# Altium schematic sheet 02-MCU.SchDoc
size A3
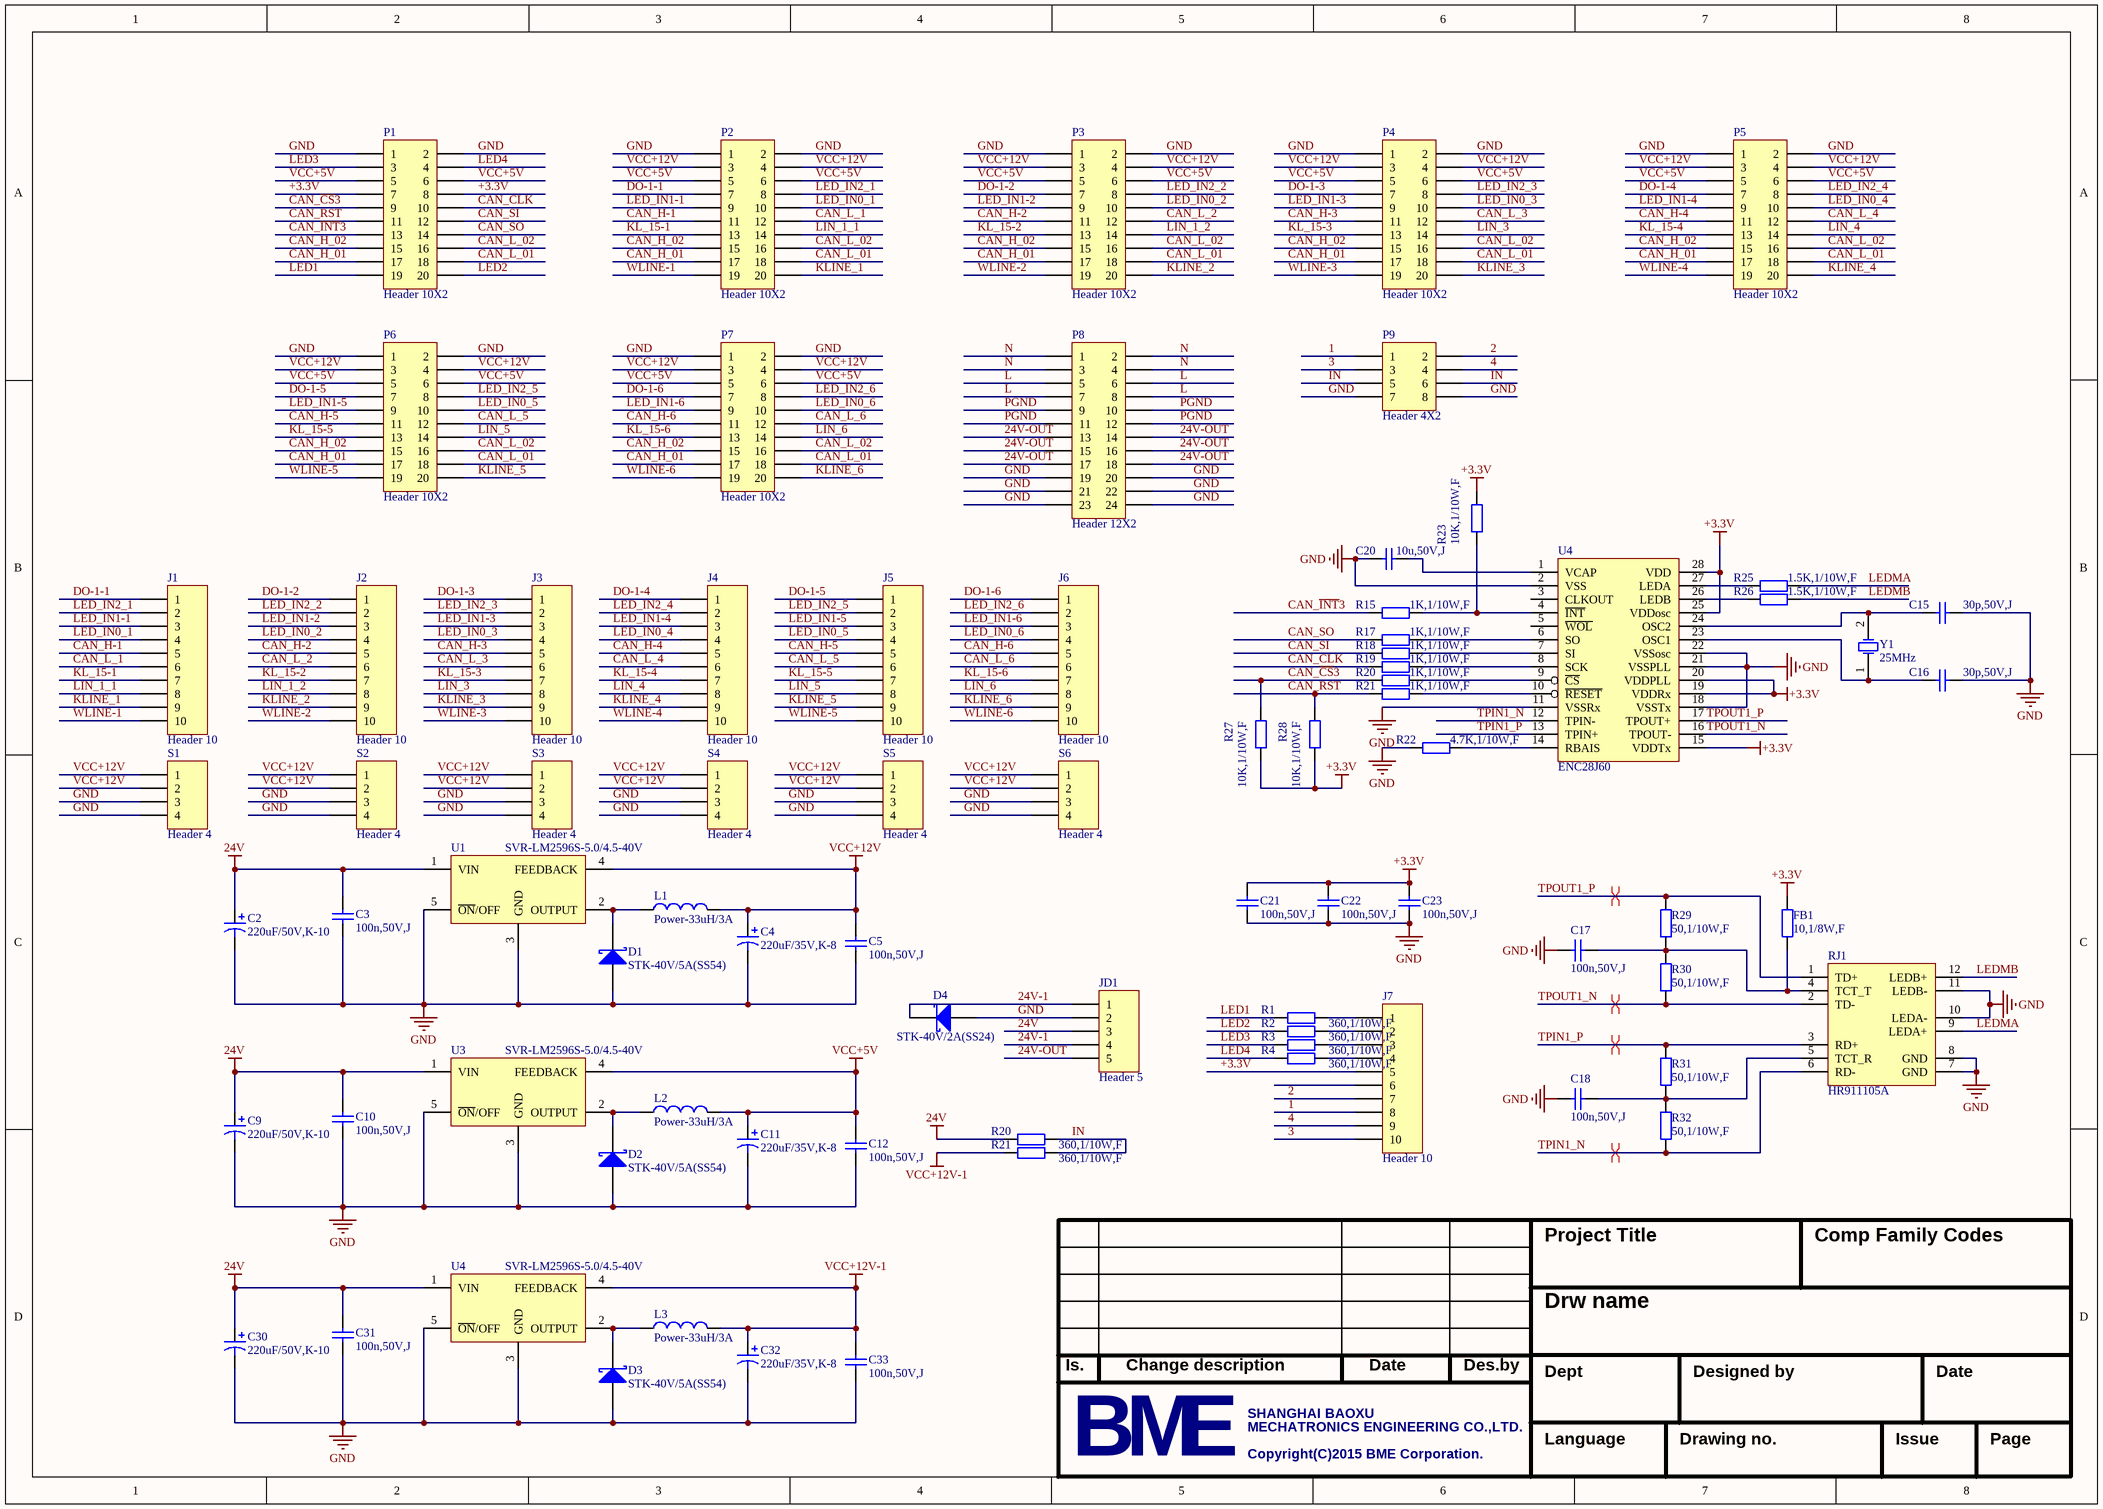
[diagram p0: 02-MCU.SchDoc]

## Parts
(Parts that share a designator on the sheet are numbered #1, #2 ... from top to bottom, then left to right.)
C2  220uF/50V,K-10  [ED10]
C3  100n,50V,J  [C0603]
C4  220uF/35V,K-8  [ED8]
C5  100n,50V,J  [C0603]
C9  220uF/50V,K-10  [ED10]
C10  100n,50V,J  [C0603]
C11  220uF/35V,K-8  [ED8]
C12  100n,50V,J  [C0603]
C15  30p,50V,J  [C0603]
C16  30p,50V,J  [C0603]
C17  100n,50V,J  [C0603]
C18  100n,50V,J  [C0603]
C20  10u,50V,J  [C0603]
C21  100n,50V,J  [C0603]
C22  100n,50V,J  [C0603]
C23  100n,50V,J  [C0603]
C30  220uF/50V,K-10  [ED10]
C31  100n,50V,J  [C0603]
C32  220uF/35V,K-8  [ED8]
C33  100n,50V,J  [C0603]
D1  STK-40V/5A(SS54)  [SMA]
D2  STK-40V/5A(SS54)  [SMA]
D3  STK-40V/5A(SS54)  [SMA]
D4  STK-40V/2A(SS24)  [SMA]
FB1  10,1/8W,F  [R0805]
J1  Header 10  [PH2.54-10V]
J2  Header 10  [PH2.54-10V]
J3  Header 10  [PH2.54-10V]
J4  Header 10  [PH2.54-10V]
J5  Header 10  [PH2.54-10V]
J6  Header 10  [PH2.54-10V]
J7  Header 10  [PH2.54-10V]
JD1  Header 5  [JDQ]
L1  Power-33uH/3A  [127]
L2  Power-33uH/3A  [127]
L3  Power-33uH/3A  [127]
P1  Header 10X2  [805-2]
P2  Header 10X2  [805-2]
P3  Header 10X2  [805-2]
P4  Header 10X2  [805-2]
P5  Header 10X2  [805-2]
P6  Header 10X2  [805-2]
P7  Header 10X2  [805-2]
P8  Header 12X2  [805-3]
P9  Header 4X2  [805-4]
R1  360,1/10W,F  [R0603]
R2  360,1/10W,F  [R0603]
R3  360,1/10W,F  [R0603]
R4  360,1/10W,F  [R0603]
R15  1K,1/10W,F  [R0603]
R17  1K,1/10W,F  [R0603]
R18  1K,1/10W,F  [R0603]
R19  1K,1/10W,F  [R0603]
R20#1  1K,1/10W,F  [R0603]
R20#2  360,1/10W,F  [R0603]
R21#1  1K,1/10W,F  [R0603]
R21#2  360,1/10W,F  [R0603]
R22  4.7K,1/10W,F  [R0603]
R23  10K,1/10W,F  [R0603]
R25  1.5K,1/10W,F  [R0603]
R26  1.5K,1/10W,F  [R0603]
R27  10K,1/10W,F  [R0603]
R28  10K,1/10W,F  [R0603]
R29  50,1/10W,F  [R0603]
R30  50,1/10W,F  [R0603]
R31  50,1/10W,F  [R0603]
R32  50,1/10W,F  [R0603]
RJ1  HR911105A  [HR911105A]
S1  Header 4  [PH2.54-4V]
S2  Header 4  [PH2.54-4V]
S3  Header 4  [PH2.54-4V]
S4  Header 4  [PH2.54-4V]
S5  Header 4  [PH2.54-4V]
S6  Header 4  [PH2.54-4V]
U1  SVR-LM2596S-5.0/4.5-40V  [SOT-263-5]
U3  SVR-LM2596S-5.0/4.5-40V  [SOT-263-5]
U4#1  ENC28J60  [SSOP28762MM]
U4#2  SVR-LM2596S-5.0/4.5-40V  [SOT-263-5]
Y1  25MHz  [X49S]

## Nets
24V: C2.1 C3.1 C9.1 C10.1 C30.1 C31.1 JD1.3 R20#2.2 U1.1(VIN) U3.1(VIN) U4#2.1(VIN)
+3.3V: C21.1 C22.1 C23.1 FB1.2 J7.5 P1.7 P1.8 R23.2 R27.2 R28.2 U4#1.15(VDDTx) U4#1.19(VDDRx) U4#1.20(VDDPLL) U4#1.25(VDDosc) U4#1.28(VDD)
GND: C2.2 C3.2 C4.2 C5.2 C9.2 C10.2 C11.2 C12.2 C15.2 C16.2 C17.2 C18.2 C20.1 C21.2 C22.2 C23.2 C30.2 C31.2 C32.2 C33.2 D1.1(A) D2.1(A) D3.1(A) D4.1(A) JD1.2 P1.1 P1.2 P2.1 P2.2 P3.1 P3.2 P4.1 P4.2 P5.1 P5.2 P6.1 P6.2 P7.1 P7.2 P8.19 P8.20 P8.21 P8.22 P8.23 P8.24 P9.7 P9.8 R22.1 RJ1.7(GND) RJ1.8(GND) RJ1.10(LEDA-) RJ1.11(LEDB-) S1.3 S1.4 S2.3 S2.4 S3.3 S3.4 S4.3 S4.4 S5.3 S5.4 S6.3 S6.4 U1.3(GND) U1.5(~{ON}/OFF) U3.3(GND) U3.5(~{ON}/OFF) U4#1.2(VSS) U4#1.11(VSSRx) U4#1.18(VSSTx) U4#1.21(VSSPLL) U4#1.22(VSSosc) U4#2.3(GND) U4#2.5(~{ON}/OFF)
VCC+5V: C11.1 C12.1 L2.2 P1.5 P1.6 P2.5 P2.6 P3.5 P3.6 P4.5 P4.6 P5.5 P5.6 P6.5 P6.6 P7.5 P7.6 U3.4(FEEDBACK)
VCC+12V: C4.1 C5.1 L1.2 P2.3 P2.4 P3.3 P3.4 P4.3 P4.4 P5.3 P5.4 P6.3 P6.4 P7.3 P7.4 S1.1 S1.2 S2.1 S2.2 S3.1 S3.2 S4.1 S4.2 S5.1 S5.2 S6.1 S6.2 U1.4(FEEDBACK)
VCC+12V-1: C32.1 C33.1 L3.2 R21#2.2 U4#2.4(FEEDBACK)
1: J7.8 P9.1
2: J7.7 P9.2
3: J7.10 P9.3
4: J7.9 P9.4
24V-1: D4.2(K) JD1.1 JD1.4
24V-OUT: JD1.5 P8.13 P8.14 P8.15 P8.16 P8.17 P8.18
CAN_~{CS}3: P1.9 R20#1.1 R27.1
CAN_CLK: P1.10 R19.1
CAN_H-1: J1.5 P2.11
CAN_H-2: J2.5 P3.11
CAN_H-3: J3.5 P4.11
CAN_H-4: J4.5 P5.11
CAN_H-5: J5.5 P6.11
CAN_H-6: J6.5 P7.11
CAN_H_01: P1.17 P2.17 P3.17 P4.17 P5.17 P6.17 P7.17
CAN_H_02: P1.15 P2.15 P3.15 P4.15 P5.15 P6.15 P7.15
CAN_~{INT}3: P1.13 R15.1
CAN_L_01: P1.18 P2.18 P3.18 P4.18 P5.18 P6.18 P7.18
CAN_L_1: J1.6 P2.12
CAN_L_02: P1.16 P2.16 P3.16 P4.16 P5.16 P6.16 P7.16
CAN_L_2: J2.6 P3.12
CAN_L_3: J3.6 P4.12
CAN_L_4: J4.6 P5.12
CAN_L_5: J5.6 P6.12
CAN_L_6: J6.6 P7.12
CAN_RST: P1.11 R21#1.1 R28.1
CAN_SI: P1.12 R18.1
CAN_SO: P1.14 R17.1
DO-1-1: J1.1 P2.7
DO-1-2: J2.1 P3.7
DO-1-3: J3.1 P4.7
DO-1-4: J4.1 P5.7
DO-1-5: J5.1 P6.7
DO-1-6: J6.1 P7.7
IN: P9.5 P9.6 R20#2.1 R21#2.1
KL_15-1: J1.7 P2.13
KL_15-2: J2.7 P3.13
KL_15-3: J3.7 P4.13
KL_15-4: J4.7 P5.13
KL_15-5: J5.7 P6.13
KL_15-6: J6.7 P7.13
KLINE_1: J1.9 P2.20
KLINE_2: J2.9 P3.20
KLINE_3: J3.9 P4.20
KLINE_4: J4.9 P5.20
KLINE_5: J5.9 P6.20
KLINE_6: J6.9 P7.20
L: P8.5 P8.6 P8.7 P8.8
LED1: P1.19 R1.2
LED2: P1.20 R2.2
LED3: P1.3 R3.2
LED4: P1.4 R4.2
LED_IN0_1: J1.4 P2.10
LED_IN0_2: J2.4 P3.10
LED_IN0_3: J3.4 P4.10
LED_IN0_4: J4.4 P5.10
LED_IN0_5: J5.4 P6.10
LED_IN0_6: J6.4 P7.10
LED_IN1-1: J1.3 P2.9
LED_IN1-2: J2.3 P3.9
LED_IN1-3: J3.3 P4.9
LED_IN1-4: J4.3 P5.9
LED_IN1-5: J5.3 P6.9
LED_IN1-6: J6.3 P7.9
LED_IN2_1: J1.2 P2.8
LED_IN2_2: J2.2 P3.8
LED_IN2_3: J3.2 P4.8
LED_IN2_4: J4.2 P5.8
LED_IN2_5: J5.2 P6.8
LED_IN2_6: J6.2 P7.8
LEDMA: R25.2 RJ1.9(LEDA+)
LEDMB: R26.2 RJ1.12(LEDB+)
LIN_1_1: J1.8 P2.14
LIN_1_2: J2.8 P3.14
LIN_3: J3.8 P4.14
LIN_4: J4.8 P5.14
LIN_5: J5.8 P6.14
LIN_6: J6.8 P7.14
N: P8.1 P8.2 P8.3 P8.4
PGND: P8.9 P8.10 P8.11 P8.12
TPIN1_N: R32.1 RJ1.6(RD-) U4#1.12(TPIN-)
TPIN1_P: R31.2 RJ1.3(RD+) U4#1.13(TPIN+)
TPOUT1_N: R30.1 RJ1.2(TD-) U4#1.16(TPOUT-)
TPOUT1_P: R29.2 RJ1.1(TD+) U4#1.17(TPOUT+)
WLINE-1: J1.10 P2.19
WLINE-2: J2.10 P3.19
WLINE-3: J3.10 P4.19
WLINE-4: J4.10 P5.19
WLINE-5: J5.10 P6.19
WLINE-6: J6.10 P7.19
NetC15_1: C15.1 U4#1.24(OSC2) Y1.2(OSC2)
NetC16_1: C16.1 U4#1.23(OSC1) Y1.1(OSC1)
NetC17_1: C17.1 FB1.1 R29.1 R30.2 RJ1.4(TCT_T)
NetC18_1: C18.1 R31.1 R32.2 RJ1.5(TCT_R)
NetC20_2: C20.2 U4#1.1(VCAP)
NetD1_2: D1.2(K) L1.1 U1.2(OUTPUT)
NetD2_2: D2.2(K) L2.1 U3.2(OUTPUT)
NetD3_2: D3.2(K) L3.1 U4#2.2(OUTPUT)
NetJ7_1: J7.1 R1.1
NetJ7_2: J7.2 R2.1
NetJ7_3: J7.3 R3.1
NetJ7_4: J7.4 R4.1
NetR15_2: R15.2 R23.1 U4#1.4(~{INT})
NetR17_2: R17.2 U4#1.6(SO)
NetR18_2: R18.2 U4#1.7(SI)
NetR19_2: R19.2 U4#1.8(SCK)
NetR20#1_2: R20#1.2 U4#1.9(~{CS})
NetR21#1_2: R21#1.2 U4#1.10(~{RESET})
NetR22_2: R22.2 U4#1.14(RBAIS)
NetR25_1: R25.1 U4#1.27(LEDA)
NetR26_1: R26.1 U4#1.26(LEDB)

Not connected (* = marked no-connect by the designer): J7 6; U4#1 3(CLKOUT) 5(~{WOL})

## Layout directives
differential pair: TPIN1_N, TPIN1_P, TPOUT1_N, TPOUT1_P

## Notes on the sheet
- Project Title
- Comp Family Codes
- Drw name
- Is.
- Change description
- Date
- Des.by
- Dept
- Designed by
- Copyright(C)2015 BME Corporation.
- SHANGHAI BAOXU
- MECHATRONICS ENGINEERING CO.,LTD.
- Language
- Drawing no.
- Issue
- Page
- B
- M
- E

## Library data of the parts
C2 C9 C30 = 30604456: Manufactuer: 三洋; Name: 贴片铝电解电容; HelpURL: *; Manufactuer P/N: *; Part Number: 30604456; Supplier: 友进芯城; 封装: ED10
C3 C5 C10 C12 C17 C18 C21-C23 C31 C33 = 30602059: Manufactuer: 三星; Manufactuer P/N: CL10B104JB8NNNC; 封装: 0603; Name: 贴片电容; Part Number: 30602059; helpURL: 306\30601\UNIOHM CHIP SERIES.pdf; Price: 0.003; Supplier: 友进芯城
C4 C11 C32 = 30604455: Manufactuer: 三洋; Name: 贴片铝电解电容; HelpURL: *; Manufactuer P/N: *; Part Number: 30604455; Supplier: 友进芯城; 封装: ED8
C15 C16 = 30602022: Manufactuer: 三星; Manufactuer P/N: CL10B300JB8NNNC; 封装: 0603; Name: 贴片电容; Part Number: 30602022; helpURL: 306\30601\UNIOHM CHIP SERIES.pdf; Price: 0.003; Supplier: 友进芯城
C20 = 30602064: Manufactuer: 三星; Manufactuer P/N: CL10B106JB8NNNC; 封装: 0603; Name: 贴片电容; Part Number: 30602064; helpURL: 306\30601\UNIOHM CHIP SERIES.pdf; Price: 0.003; Supplier: 友进芯城
D1-D3 = 30607216: Manufactuer: 立创; Name: 贴片二极管; HelpURL: *; Part Number: 30607216; Supplier: 友进芯城; 封装: SMA
D4 = 30607209: Manufactuer: 立创; HelpURL: *; Part Number: 30607209; Supplier: 友进芯城; 封装: SMA
FB1 = 30601226: Manufactuer: 厚声; Manufactuer P/N: 0805W8F100JT5E; 封装: 0805; Name: 贴片电阻; Part Number: 30601226; helpURL: 306\30601\UNIOHM CHIP SERIES.pdf; Price: 0.03; Supplier: 友进芯城
J1-J7 = Header 10: Header, 10-Pin; LatestRevisionDate: 17-Jul-2002; LatestRevisionNote: Re-released for DXP Platform.; Publisher: Altium Limited
JD1 = Header 5: Header, 5-Pin; LatestRevisionDate: 17-Jul-2002; LatestRevisionNote: Re-released for DXP Platform.; Publisher: Altium Limited
L1-L3 = 30606017: Manufactuer: 立创; Name: 贴片绕线功率电感; HelpURL: *; Part Number: 30606017; Supplier: 友进芯城; 封装: 127
P1-P7 = Header 10X2: Header, 10-Pin, Dual row; LatestRevisionDate: 17-Jul-2002; LatestRevisionNote: Re-released for DXP Platform.; Publisher: Altium Limited
P8 = Header 12X2: Header, 12-Pin, Dual row; LatestRevisionDate: 17-Jul-2002; LatestRevisionNote: Re-released for DXP Platform.; Publisher: Altium Limited
P9 = Header 4X2: Header, 4-Pin, Dual row; LatestRevisionDate: 17-Jul-2002; LatestRevisionNote: Re-released for DXP Platform.; Publisher: Altium Limited
R1-R4 R20#2 R21#2 = 30601064: Manufactuer: 厚声; Manufactuer P/N: 0603WAF3600T5E; 封装: 0603; Name: 贴片电阻; Part Number: 30601064; helpURL: 306\30601\UNIOHM CHIP SERIES.pdf; Price: 0.03; Supplier: 友进芯城
R15 R17-R19 R20#1 R21#1 = 30601075: Manufactuer: 厚声; Manufactuer P/N: 0603F1001T5E; 封装: 0603; Name: 贴片电阻; Part Number: 30601075; helpURL: 306\30601\UNIOHM CHIP SERIES.pdf; Price: 0.03; Supplier: 友进芯城
R22 = 30601091: Manufactuer: 厚声; Manufactuer P/N: 0603WAF4701T5E; 封装: 0603; Name: 贴片电阻; Part Number: 30601091; helpURL: 306\30601\UNIOHM CHIP SERIES.pdf; Price: 0.03; Supplier: 友进芯城
R23 R27 R28 = 30601099: Manufactuer: 厚声; Manufactuer P/N: 0603 F1002T5E; 封装: 0603; Name: 贴片电阻; Part Number: 30601099; helpURL: 306\30601\UNIOHM CHIP SERIES.pdf; Price: 0.03; Supplier: 友进芯城
R25 R26 = 30601079: Manufactuer: 厚声; Manufactuer P/N: 0603WAF1501T5E; 封装: 0603; Name: 贴片电阻; Part Number: 30601079; helpURL: 306\30601\UNIOHM CHIP SERIES.pdf; Price: 0.03; Supplier: 友进芯城
R29-R32 = 30601043: 51,1/10W,F; Manufactuer: 厚声; Manufactuer P/N: 0603WAF510JT5E; 封装: 0603; Name: 贴片电阻; Part Number: 30601043; helpURL: 306\30601\UNIOHM CHIP SERIES.pdf; Price: 0.03; Supplier: 友进芯城
S1-S6 = Header 4: Header, 4-Pin; LatestRevisionDate: 17-Jul-2002; LatestRevisionNote: Re-released for DXP Platform.; Publisher: Altium Limited
U1 U3 U4#2 = 30614002: Manufactuer: TI; Name: 电源芯片; HelpURL: *; Manufactuer P/N: *; Part Number: 30614002; Supplier: 友进芯城; 封装: SOT-263-5
Y1 = 30612003: 16MHz; Manufactuer: EPSON; Manufactuer P/N: FC-135; Name: 晶振; 封装: 3215; HelpURL: *; Part Number: 30612003; Supplier: 友进芯城; Price: 1.26